# EAGLE design ecg_prototype_1 (EAGLE 9.6.1)
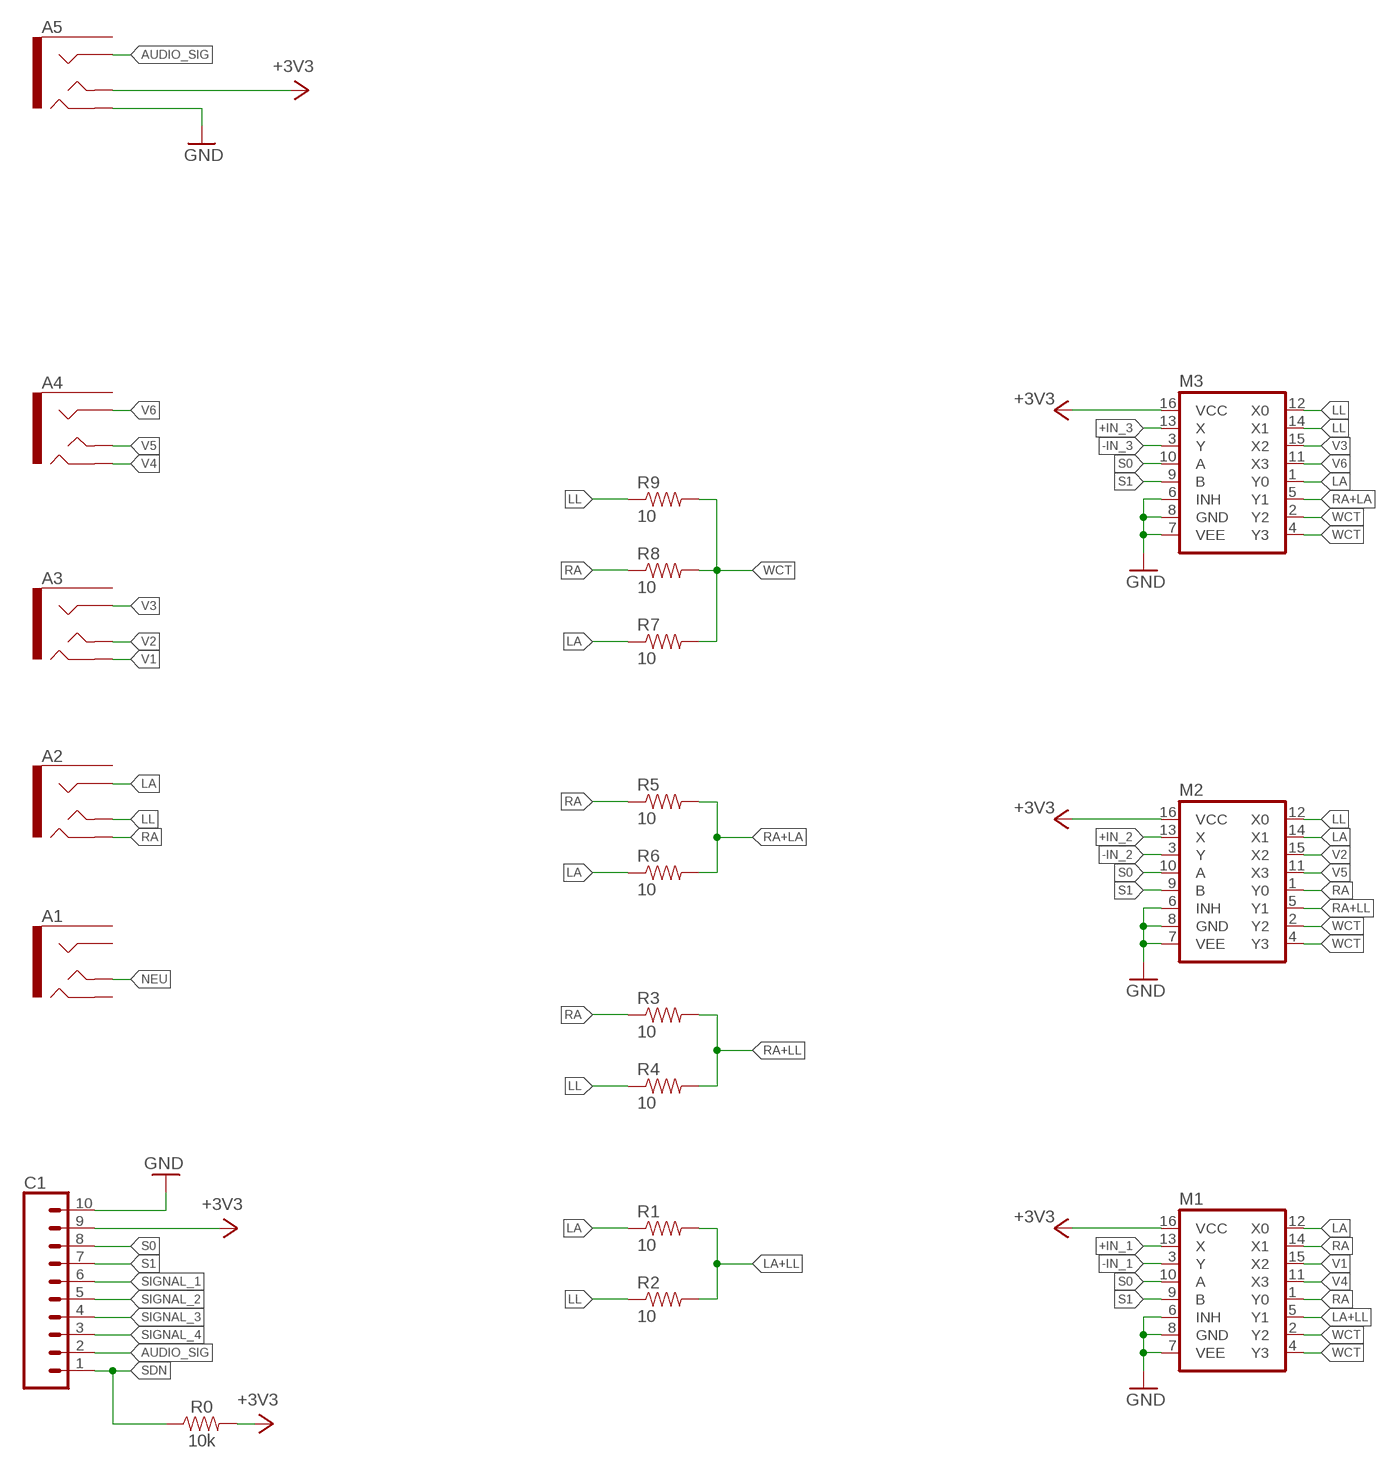
[diagram p0: schematic, sheet 1, part 1 of 2]
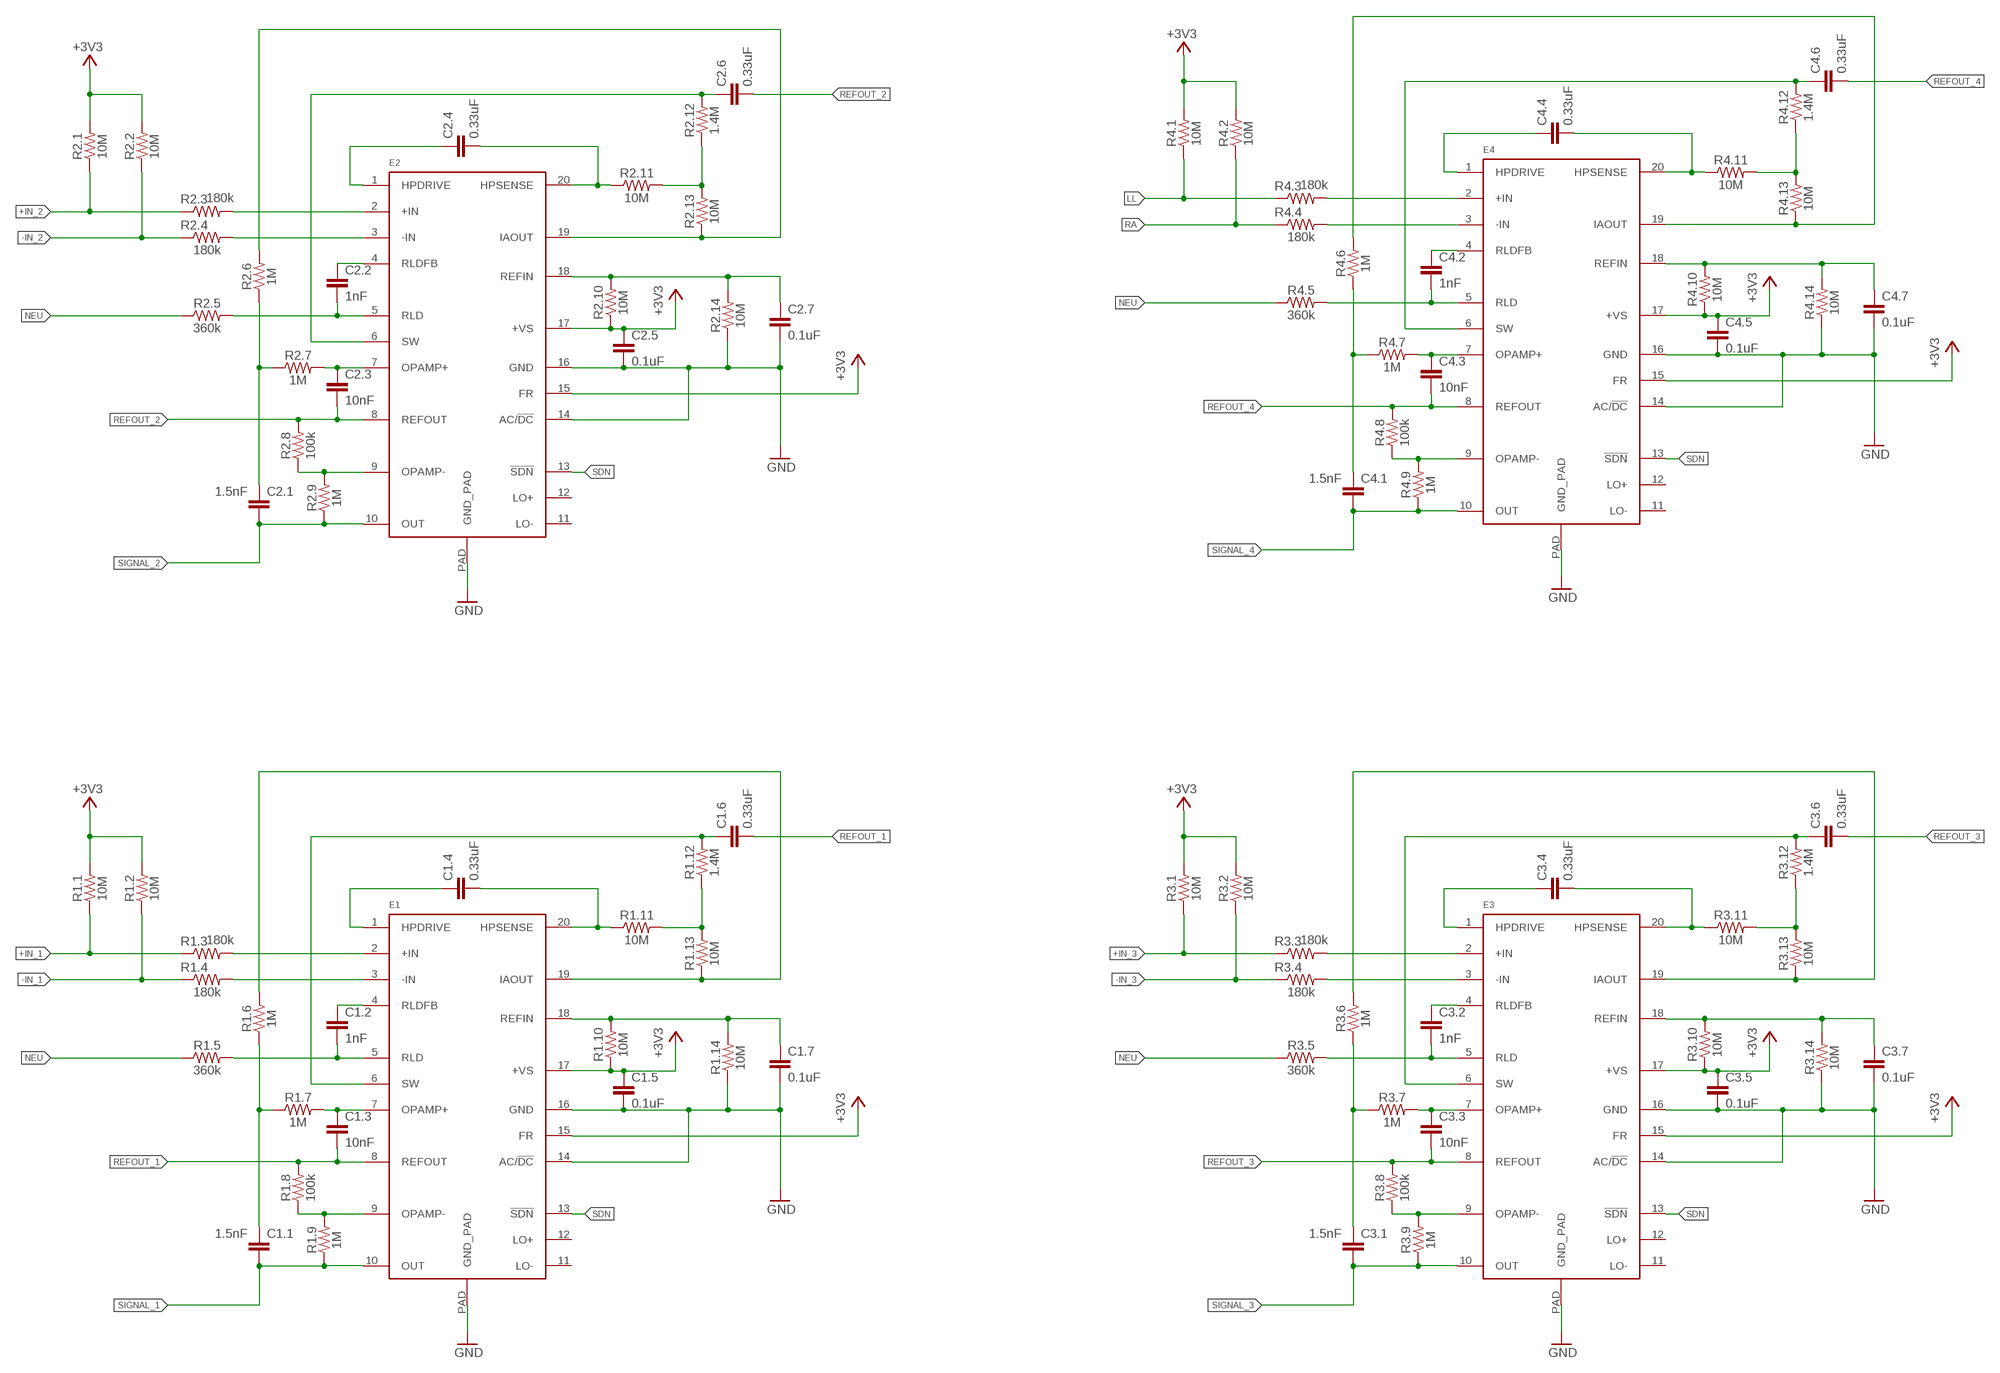
[diagram p1: schematic, sheet 1, part 2 of 2]

## Parts
A1  AUDIO_JACK_TRRSSMD_RA  [AUDIO_JACK_3.5MM_TRRS_SMD_RA]
A2  AUDIO_JACK_TRRSSMD_RA  [AUDIO_JACK_3.5MM_TRRS_SMD_RA]
A3  AUDIO_JACK_TRRSSMD_RA  [AUDIO_JACK_3.5MM_TRRS_SMD_RA]
A4  AUDIO_JACK_TRRSSMD_RA  [AUDIO_JACK_3.5MM_TRRS_SMD_RA]
A5  AUDIO_JACK_TRRSSMD_RA  [AUDIO_JACK_3.5MM_TRRS_SMD_RA]
C1  CONN_10"  [1X10]
C1.1  1.5nF  CAP0603-CAP  [0603-CAP]
C1.2  1nF  CAP0603-CAP  [0603-CAP]
C1.3  10nF  CAP0603-CAP  [0603-CAP]
C1.4  0.33uF  CAP0805  [0805]
C1.5  0.1uF  CAP0603-CAP  [0603-CAP]
C1.6  0.33uF  CAP0805  [0805]
C1.7  0.1uF  CAP0603-CAP  [0603-CAP]
C2.1  1.5nF  CAP0603-CAP  [0603-CAP]
C2.2  1nF  CAP0603-CAP  [0603-CAP]
C2.3  10nF  CAP0603-CAP  [0603-CAP]
C2.4  0.33uF  CAP0805  [0805]
C2.5  0.1uF  CAP0603-CAP  [0603-CAP]
C2.6  0.33uF  CAP0805  [0805]
C2.7  0.1uF  CAP0603-CAP  [0603-CAP]
C3.1  1.5nF  CAP0603-CAP  [0603-CAP]
C3.2  1nF  CAP0603-CAP  [0603-CAP]
C3.3  10nF  CAP0603-CAP  [0603-CAP]
C3.4  0.33uF  CAP0805  [0805]
C3.5  0.1uF  CAP0603-CAP  [0603-CAP]
C3.6  0.33uF  CAP0805  [0805]
C3.7  0.1uF  CAP0603-CAP  [0603-CAP]
C4.1  1.5nF  CAP0603-CAP  [0603-CAP]
C4.2  1nF  CAP0603-CAP  [0603-CAP]
C4.3  10nF  CAP0603-CAP  [0603-CAP]
C4.4  0.33uF  CAP0805  [0805]
C4.5  0.1uF  CAP0603-CAP  [0603-CAP]
C4.6  0.33uF  CAP0805  [0805]
C4.7  0.1uF  CAP0603-CAP  [0603-CAP]
E1  AD8232ACPZ-R7  AD8232  [LFCSP_20]
E2  AD8232ACPZ-R7  AD8232  [LFCSP_20]
E3  AD8232ACPZ-R7  AD8232  [LFCSP_20]
E4  AD8232ACPZ-R7  AD8232  [LFCSP_20]
M1  74HC4052D  [SO16]
M2  74HC4052D  [SO16]
M3  74HC4052D  [SO16]
R0  10k  10KOHM-0603-1/10W-1%  [0603]
R1  10  RESISTOR0402-RES  [0402-RES]
R1.1  10M  RESISTOR0603  [0603]
R1.2  10M  RESISTOR0603  [0603]
R1.3  180k  RESISTOR0603  [0603]
R1.4  180k  RESISTOR0603  [0603]
R1.5  360k  RESISTOR0603  [0603]
R1.6  1M  RESISTOR0603  [0603]
R1.7  1M  RESISTOR0603  [0603]
R1.8  100k  RESISTOR0603  [0603]
R1.9  1M  RESISTOR0603  [0603]
R1.10  10M  RESISTOR0603  [0603]
R1.11  10M  RESISTOR0603  [0603]
R1.12  1.4M  RESISTOR0603  [0603]
R1.13  10M  RESISTOR0603  [0603]
R1.14  10M  RESISTOR0603  [0603]
R2  10  RESISTOR0402-RES  [0402-RES]
R2.1  10M  RESISTOR0603  [0603]
R2.2  10M  RESISTOR0603  [0603]
R2.3  180k  RESISTOR0603  [0603]
R2.4  180k  RESISTOR0603  [0603]
R2.5  360k  RESISTOR0603  [0603]
R2.6  1M  RESISTOR0603  [0603]
R2.7  1M  RESISTOR0603  [0603]
R2.8  100k  RESISTOR0603  [0603]
R2.9  1M  RESISTOR0603  [0603]
R2.10  10M  RESISTOR0603  [0603]
R2.11  10M  RESISTOR0603  [0603]
R2.12  1.4M  RESISTOR0603  [0603]
R2.13  10M  RESISTOR0603  [0603]
R2.14  10M  RESISTOR0603  [0603]
R3  10  RESISTOR0402-RES  [0402-RES]
R3.1  10M  RESISTOR0603  [0603]
R3.2  10M  RESISTOR0603  [0603]
R3.3  180k  RESISTOR0603  [0603]
R3.4  180k  RESISTOR0603  [0603]
R3.5  360k  RESISTOR0603  [0603]
R3.6  1M  RESISTOR0603  [0603]
R3.7  1M  RESISTOR0603  [0603]
R3.8  100k  RESISTOR0603  [0603]
R3.9  1M  RESISTOR0603  [0603]
R3.10  10M  RESISTOR0603  [0603]
R3.11  10M  RESISTOR0603  [0603]
R3.12  1.4M  RESISTOR0603  [0603]
R3.13  10M  RESISTOR0603  [0603]
R3.14  10M  RESISTOR0603  [0603]
R4  10  RESISTOR0402-RES  [0402-RES]
R4.1  10M  RESISTOR0603  [0603]
R4.2  10M  RESISTOR0603  [0603]
R4.3  180k  RESISTOR0603  [0603]
R4.4  180k  RESISTOR0603  [0603]
R4.5  360k  RESISTOR0603  [0603]
R4.6  1M  RESISTOR0603  [0603]
R4.7  1M  RESISTOR0603  [0603]
R4.8  100k  RESISTOR0603  [0603]
R4.9  1M  RESISTOR0603  [0603]
R4.10  10M  RESISTOR0603  [0603]
R4.11  10M  RESISTOR0603  [0603]
R4.12  1.4M  RESISTOR0603  [0603]
R4.13  10M  RESISTOR0603  [0603]
R4.14  10M  RESISTOR0603  [0603]
R5  10  RESISTOR0402-RES  [0402-RES]
R6  10  RESISTOR0402-RES  [0402-RES]
R7  10  RESISTOR0402-RES  [0402-RES]
R8  10  RESISTOR0402-RES  [0402-RES]
R9  10  RESISTOR0402-RES  [0402-RES]

## Nets
+3V3: A5.TIP C1.5.1 C1.9 C2.5.1 C3.5.1 C4.5.1 E1.15(FR) E1.17(+VS) E2.15(FR) E2.17(+VS) E3.15(FR) E3.17(+VS) E4.15(FR) E4.17(+VS) M1.16(VCC) M2.16(VCC) M3.16(VCC) R0.2 R1.1.2 R1.2.2 R1.10.1 R2.1.2 R2.2.2 R2.10.1 R3.1.2 R3.2.2 R3.10.1 R4.1.2 R4.2.2 R4.10.1
+IN_1: M1.13(X) R1.1.1 R1.3.1
+IN_2: M2.13(X) R2.1.1 R2.3.1
+IN_3: M3.13(X) R3.1.1 R3.3.1
-IN_1: M1.3(Y) R1.2.1 R1.4.1
-IN_2: M2.3(Y) R2.2.1 R2.4.1
-IN_3: M3.3(Y) R3.2.1 R3.4.1
AUDIO_SIG: A5.RING1 C1.2
GND: A5.RING2 C1.5.2 C1.7.2 C1.10 C2.5.2 C2.7.2 C3.5.2 C3.7.2 C4.5.2 C4.7.2 E1.14(AC/!DC) E1.16(GND) E1.PAD(GND_PAD) E2.14(AC/!DC) E2.16(GND) E2.PAD(GND_PAD) E3.14(AC/!DC) E3.16(GND) E3.PAD(GND_PAD) E4.14(AC/!DC) E4.16(GND) E4.PAD(GND_PAD) M1.6(INH) M1.7(VEE) M1.8(GND) M2.6(INH) M2.7(VEE) M2.8(GND) M3.6(INH) M3.7(VEE) M3.8(GND) R1.14.1 R2.14.1 R3.14.1 R4.14.1
LA: A2.RING1 M1.12(X0) M2.14(X1) M3.1(Y0) R1.1 R6.1 R7.1
LA+LL: M1.5(Y1) R1.2 R2.2
LL: A2.TIP M2.12(X0) M3.12(X0) M3.14(X1) R2.1 R4.1 R4.1.1 R4.3.1 R9.1
N$1: E1.9(OPAMP-) R1.8.1 R1.9.2
N$2: E2.2(+IN) R2.3.2
N$3: E1.2(+IN) R1.3.2
N$4: E1.3(-IN) R1.4.2
N$5: E2.3(-IN) R2.4.2
N$6: C1.1.1 R1.6.1 R1.7.1
N$7: C1.3.1 E1.7(OPAMP+) R1.7.2
N$8: C1.2.1 E1.4(RLDFB)
N$9: C1.2.2 E1.5(RLD) R1.5.2
N$10: E1.19(IAOUT) R1.6.2 R1.13.1
N$11: C1.6.1 E1.6(SW) R1.12.2
N$12: C1.7.1 E1.18(REFIN) R1.10.2 R1.14.2
N$13: R1.11.2 R1.12.1 R1.13.2
N$14: C1.4.2 E1.20(HPSENSE) R1.11.1
N$15: C1.4.1 E1.1(HPDRIVE)
N$16: C2.2.1 E2.4(RLDFB)
N$17: C2.2.2 E2.5(RLD) R2.5.2
N$19: C2.1.1 R2.6.1 R2.7.1
N$20: C2.3.1 E2.7(OPAMP+) R2.7.2
N$21: E2.9(OPAMP-) R2.8.1 R2.9.2
N$22: E2.19(IAOUT) R2.6.2 R2.13.1
N$23: C2.6.1 E2.6(SW) R2.12.2
N$24: R2.11.2 R2.12.1 R2.13.2
N$25: C2.4.2 E2.20(HPSENSE) R2.11.1
N$26: C2.4.1 E2.1(HPDRIVE)
N$27: C2.7.1 E2.18(REFIN) R2.10.2 R2.14.2
N$28: E3.2(+IN) R3.3.2
N$29: E3.3(-IN) R3.4.2
N$30: C3.2.1 E3.4(RLDFB)
N$31: C3.2.2 E3.5(RLD) R3.5.2
N$32: C3.1.1 R3.6.1 R3.7.1
N$33: C3.3.1 E3.7(OPAMP+) R3.7.2
N$34: E3.9(OPAMP-) R3.8.1 R3.9.2
N$35: E3.19(IAOUT) R3.6.2 R3.13.1
N$36: C3.6.1 E3.6(SW) R3.12.2
N$37: R3.11.2 R3.12.1 R3.13.2
N$38: C3.4.2 E3.20(HPSENSE) R3.11.1
N$39: C3.4.1 E3.1(HPDRIVE)
N$40: C3.7.1 E3.18(REFIN) R3.10.2 R3.14.2
N$41: E4.2(+IN) R4.3.2
N$42: E4.3(-IN) R4.4.2
N$43: C4.2.1 E4.4(RLDFB)
N$44: C4.2.2 E4.5(RLD) R4.5.2
N$45: C4.1.1 R4.6.1 R4.7.1
N$46: C4.3.1 E4.7(OPAMP+) R4.7.2
N$47: E4.9(OPAMP-) R4.8.1 R4.9.2
N$48: E4.19(IAOUT) R4.6.2 R4.13.1
N$49: C4.6.1 E4.6(SW) R4.12.2
N$50: R4.11.2 R4.12.1 R4.13.2
N$51: C4.4.2 E4.20(HPSENSE) R4.11.1
N$52: C4.4.1 E4.1(HPDRIVE)
N$53: C4.7.1 E4.18(REFIN) R4.10.2 R4.14.2
NEU: A1.TIP R1.5.1 R2.5.1 R3.5.1 R4.5.1
RA: A2.RING2 M1.1(Y0) M1.14(X1) M2.1(Y0) R3.1 R4.2.1 R4.4.1 R5.1 R8.1
RA+LA: M3.5(Y1) R5.2 R6.2
RA+LL: M2.5(Y1) R3.2 R4.2
REFOUT_1: C1.3.2 C1.6.2 E1.8(REFOUT) R1.8.2
REFOUT_2: C2.3.2 C2.6.2 E2.8(REFOUT) R2.8.2
REFOUT_3: C3.3.2 C3.6.2 E3.8(REFOUT) R3.8.2
REFOUT_4: C4.3.2 C4.6.2 E4.8(REFOUT) R4.8.2
S0: C1.8 M1.10(A) M2.10(A) M3.10(A)
S1: C1.7 M1.9(B) M2.9(B) M3.9(B)
SDN: C1.1 E1.13(!SDN) E2.13(!SDN) E3.13(!SDN) E4.13(!SDN) R0.1
SIGNAL_1: C1.1.2 C1.6 E1.10(OUT) R1.9.1
SIGNAL_2: C1.5 C2.1.2 E2.10(OUT) R2.9.1
SIGNAL_3: C1.4 C3.1.2 E3.10(OUT) R3.9.1
SIGNAL_4: C1.3 C4.1.2 E4.10(OUT) R4.9.1
V1: A3.RING2 M1.15(X2)
V2: A3.TIP M2.15(X2)
V3: A3.RING1 M3.15(X2)
V4: A4.RING2 M1.11(X3)
V5: A4.TIP M2.11(X3)
V6: A4.RING1 M3.11(X3)
WCT: M1.2(Y2) M1.4(Y3) M2.2(Y2) M2.4(Y3) M3.2(Y2) M3.4(Y3) R7.2 R8.2 R9.2
Unconnected: A1.EARTH A1.RING1 A1.RING2 A2.EARTH A3.EARTH A4.EARTH A5.EARTH E1.11(LO-) E1.12(LO+) E2.11(LO-) E2.12(LO+) E3.11(LO-) E3.12(LO+) E4.11(LO-) E4.12(LO+)

## Library data of the parts
A1-A5 = SparkFun-Connectors:AUDIO_JACK_TRRS: Audio Jack - 3.5mm TRRS (SMD) This is a 3.5mm TRRS SMD audio jack. TRRS connectors are the audio-style connectors that you see on some phones, MP3 players and development boards. TRRS stands for “tip, ring, ring, sleeve,” which reflects that this has three conductors and a ground. SparkFun Products: Audio Jack <https://www.sparkfun.com/products/12639> mbed Starter Kit <https://www.sparkfun.com/products/12968> SparkFun TRRS 3.5mm Jack Breakout <https://www.sparkfun.com/products/11570>; PROD_ID: CONN-10676; SF_ID: PRT-12639
C1 = SparkFun-Connectors:CONN_10: Multi connection point. Often used as Generic Header-pin footprint for 0.1 inch spaced/style header connections On any of the 0.1 inch spaced packages, you can populate with these: Break Away Headers - Straight <https://www.sparkfun.com/products/116> (PRT-00116) Break Away Male Headers - Right Angle <https://www.sparkfun.com/products/553> (PRT-00553) Female Headers <https://www.sparkfun.com/products/115> (PRT-00115) Break Away Headers - Machine Pin <https://www.sparkfun.com/products/117> (PRT-00117) Break Away Female Headers - Swiss Machine Pin <https://www.sparkfun.com/products/743> (PRT-00743) Arduino Stackable Header - 10 Pin <https://www.sparkfun.com/products/11376> (PRT-11376) For SCREWTERMINALS and SPRING TERMINALS visit here: Screw Terimnals on SparkFun.com <https://www.sparkfun.com/search/results?term=Screw+Terminals> (5mm/3.5mm/2.54mm spacing) This device is also useful as a general connection point to wire up your design to another part of your project. Our various solder wires solder well into these plated through hole pads. Hook-Up Wire - Assortment (Stranded, 22 AWG) <https://www.sparkfun.com/products/11375> (PRT-11375) Hook-Up Wire - Assortment (Solid Core, 22 AWG) <https://www.sparkfun.com/products/11367> (PRT-11367) View the entire wire category on our website here <https://www.sparkfun.com/categories/141> Special notes: Molex polarized connector foot print use with SKU : PRT-08231 with associated crimp pins and housings. 1MM SMD Version SKU: PRT-10208 NOTES ON THE VARIANTS LOCK and LOCK_LONGPADS... This footprint was designed to help hold the alignment of a through-hole component (i.e. 6-pin header) while soldering it into place. You may notice that each hole has been shifted either up or down by 0.005 of an inch from it's more standard position (which is a perfectly straight line). This slight alteration caused the pins (the squares in the middle) to touch the edges of the holes. Because they are alternating, it causes a "brace" to hold the component in place. 0.005 has proven to be the perfect amount of "off-center" position when using our standard breakaway headers. Although looks a little odd when you look at the bare footprint, once you have a header in there, the alteration is very hard to notice. Also,if you push a header all the way into place, it is covered up entirely on the bottom side.; PROD_ID: CONN-11563
C1.1-C1.7 C2.1-C2.7 C3.1-C3.7 C4.1-C4.7 = SparkFun-Passives:CAP: Capacitor Standard 0603 ceramic capacitor, and 0.1" leaded capacitor.
E1-E4 = SparkFun-Sensors:AD8232: AD8232 Single Lead Heart Rate Monitor IC Datasheet <https://cdn.sparkfun.com/datasheets/Sensors/Biometric/AD8232.pdf> SparkFun Products SparkFun Single Lead Heart Rate Monitor - AD8232 <https://www.sparkfun.com/products/12650> (SEN-12650); PROD_ID: IC-11886
M1-M3 = SparkFun-IC-Logic:74*4052: Dual 4:1 Analog Mux Dual four-channel analog MULTIPLEXER / DEMULTIPLEXER SparkFun Products SparkFun Vernier Interface Shield <https://www.sparkfun.com/products/12858> (DEV-12858); PROD_ID: IC-13103
R0 = SparkFun-Resistors:10KOHM: 10kΩ resistor A resistor is a passive two-terminal electrical component that implements electrical resistance as a circuit element. Resistors act to reduce current flow, and, at the same time, act to lower voltage levels within circuits. - Wikipedia; PROD_ID: RES-00824
R1-R9 = SparkFun:RESISTOR: Resistor Basic schematic elements and footprints for 0603, 1206, and PTH resistors.
R1.1-R1.14 R2.1-R2.14 R3.1-R3.14 R4.1-R4.14 = SparkFun-Resistors:RESISTOR: Generic Resistor Package

## Board
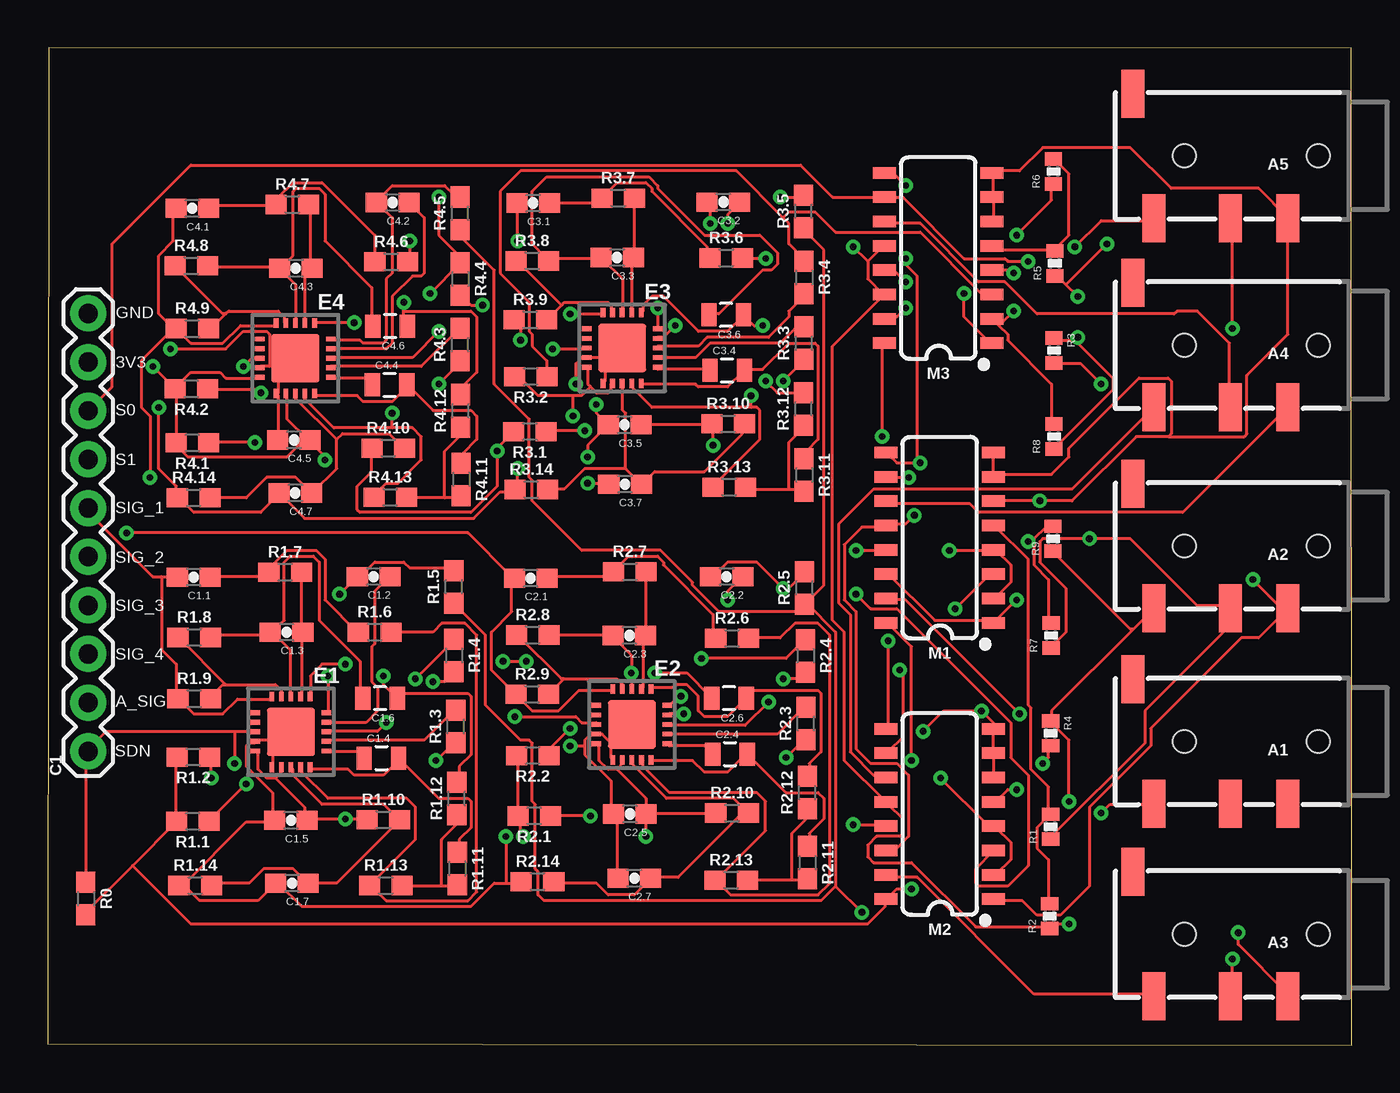
[diagram p2: board, top side]
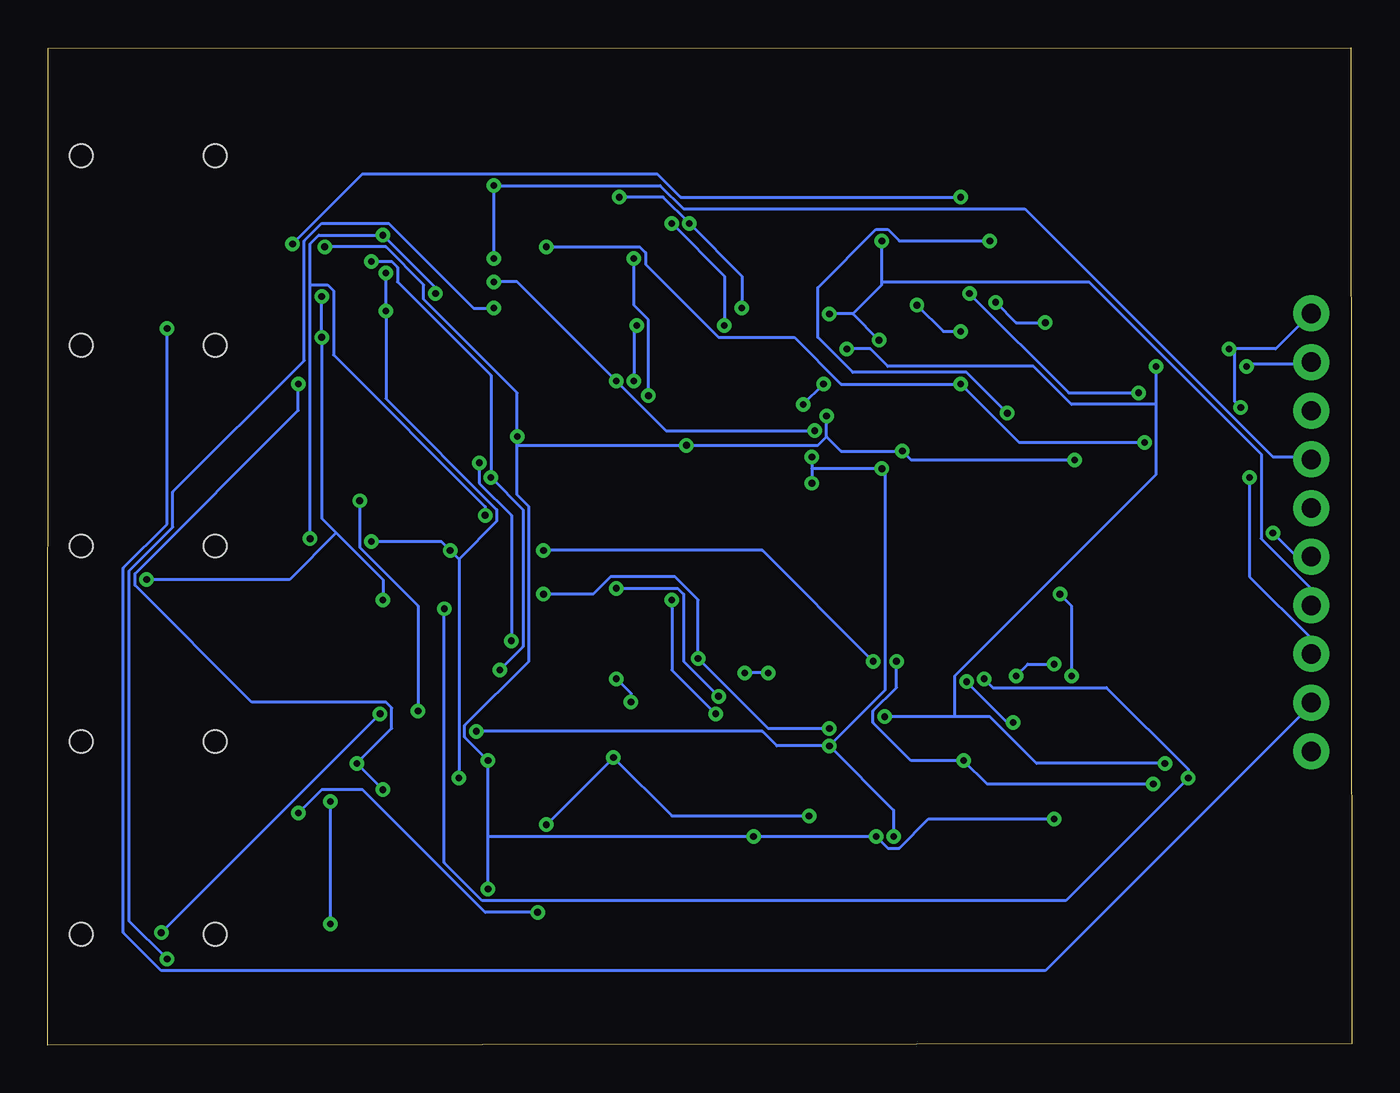
[diagram p3: board, bottom side, seen from below]

Size 68.1 x 52.07 mm. Coordinates in mm from the lower left corner, seen from the top.
Outline: 0,0.08 68.1,0 68.08,52.05 0.05,52.07 0,0.08
Copper layers (1*16): Top 0.035mm / dielectric 1.5mm / Bottom 0.035mm
Design rules "default": minimum track width 6mil, minimum drill 0.35mm, track to track 6mil, track to pad 6mil, pad to pad 6mil, via to via 6mil, smd to smd 6mil, copper to edge 40mil, drill to drill 6mil, minimum pad ring 10mil, minimum via ring 8mil, stop-mask expansion 4mil, vias tented up to drill 0mil, thermal gap 10mil

### Footprints (pad centres in the part's own frame; a part is rotated, then mirrored left to right if it is on the bottom)
AUDIO_JACK_3.5MM_TRRS_SMD_RA = smd 1.2 x 2.5: EARTH 11.3,-3.25; RING1 6.2,3.25; RING2 3.2,3.25; TIP 10.2,3.25 | hole 1.2: 1.6,0; 8.6,0
1X10 = drill 1.016 pad 1.88: 1 0,0; 2 2.54,0; 3 5.08,0; 4 7.62,0; 5 10.16,0; 6 12.7,0; 7 15.24,0; 8 17.78,0; 9 20.32,0; 10 22.86,0
0603-CAP = smd 1.1 x 1: 1 -0.85,0; 2 0.85,0
0805 = smd 0.8 x 1.2: 1 -0.9,0; 2 0.9,0
LFCSP_20 = smd 0.5 x 0.25: 1 -1.85,1; 2 -1.85,0.5; 3 -1.85,0; 4 -1.85,-0.5; 5 -1.85,-1; 11 1.85,-1; 12 1.85,-0.5; 13 1.85,0; 14 1.85,0.5; 15 1.85,1 | smd 0.25 x 0.5: 6 -1,-1.85; 7 -0.5,-1.85; 8 0,-1.85; 9 0.5,-1.85; 10 1,-1.85; 16 1,1.85; 17 0.5,1.85; 18 0,1.85; 19 -0.5,1.85; 20 -1,1.85 | smd 2.5 x 2.5: PAD 0,0
SO16 = smd 0.6 x 1.2: 1 -4.445,-2.8; 2 -3.175,-2.8; 3 -1.905,-2.8; 4 -0.635,-2.8; 5 0.635,-2.8; 6 1.905,-2.8; 7 3.175,-2.8; 8 4.445,-2.8; 9 4.445,2.8; 10 3.175,2.8; 11 1.905,2.8; 12 0.635,2.8; 13 -0.635,2.8; 14 -1.905,2.8; 15 -3.175,2.8; 16 -4.445,2.8
0603 = smd 1.1 x 1: 1 -0.85,0; 2 0.85,0
0402-RES = smd 0.7 x 0.9: 1 -0.65,0; 2 0.65,0

### Placement (x,y rotation side)
A1  67.97,15.85 180 top
A2  67.97,26.06 180 top
A3  67.97,5.79 180 top
A4  67.97,36.55 180 top
A5  67.97,46.43 180 top
C1  2.11,15.34 90 top
C1.1  7.62,24.43 180 top
C1.2  17.02,24.46 180 top
C1.3  12.47,21.56 180 top
C1.4  17.42,14.99 0 top
C1.5  12.7,11.73 180 top
C1.6  17.35,18.11 180 top
C1.7  12.75,8.46 180 top
C2.1  25.22,24.38 180 top
C2.2  35.46,24.46 180 top
C2.3  30.38,21.39 180 top
C2.4  35.64,15.19 0 top
C2.5  30.4,12.06 180 top
C2.6  35.59,18.11 180 top
C2.7  30.63,8.71 180 top
C3.1  25.35,43.97 180 top
C3.2  35.28,44.02 180 top
C3.3  29.74,41.12 180 top
C3.4  35.48,35.23 0 top
C3.5  30.12,32.38 180 top
C3.6  35.43,38.13 180 top
C3.7  30.15,29.29 180 top
C4.1  7.54,43.69 180 top
C4.2  18.01,43.99 180 top
C4.3  12.95,40.56 180 top
C4.4  17.86,34.47 0 top
C4.5  12.85,31.6 180 top
C4.6  17.88,37.54 180 top
C4.7  12.93,28.83 180 top
E1  12.7,16.36 180 top
E2  30.51,16.74 180 top
E3  30,36.4 180 top
E4  12.93,35.86 180 top
M1  46.58,26.49 90 top
M2  46.58,12.06 90 top
M3  46.51,41.1 90 top
R0  1.98,7.65 270 top
R1  52.37,11.4 90 top
R1.1  7.57,11.68 180 top
R1.2  7.59,15.04 180 top
R1.3  21.31,16.64 90 top
R1.4  21.21,20.35 270 top
R1.5  21.21,23.93 90 top
R1.6  17.07,21.56 0 top
R1.7  12.4,24.69 0 top
R1.8  7.65,21.29 0 top
R1.9  7.65,18.08 0 top
R1.10  17.53,11.76 0 top
R1.11  21.39,9.22 270 top
R1.12  21.36,12.88 90 top
R1.13  17.65,8.33 0 top
R1.14  7.7,8.33 0 top
R2  52.32,6.73 90 top
R2.1  25.4,11.96 180 top
R2.2  25.32,15.11 180 top
R2.3  39.6,16.79 90 top
R2.4  39.57,20.32 270 top
R2.5  39.52,23.88 90 top
R2.6  35.74,21.23 0 top
R2.7  30.4,24.71 0 top
R2.8  25.32,21.41 0 top
R2.9  25.3,18.31 0 top
R2.10  35.74,12.12 0 top
R2.11  39.67,9.53 270 top
R2.12  39.67,13.18 90 top
R2.13  35.69,8.61 0 top
R2.14  25.58,8.53 0 top
R3  52.55,36.27 270 top
R3.1  25.17,32.03 180 top
R3.2  25.22,34.9 180 top
R3.3  39.5,36.65 90 top
R3.4  39.5,40.08 270 top
R3.5  39.47,43.54 90 top
R3.6  35.43,41.1 0 top
R3.7  29.79,44.22 0 top
R3.8  25.3,40.94 0 top
R3.9  25.2,37.87 0 top
R3.10  35.53,32.44 0 top
R3.11  39.5,29.77 270 top
R3.12  39.47,33.22 90 top
R3.13  35.59,29.13 0 top
R3.14  25.25,29.01 0 top
R4  52.37,16.28 270 top
R4.1  7.54,31.45 180 top
R4.2  7.49,34.26 180 top
R4.3  21.54,36.58 90 top
R4.4  21.54,40.01 270 top
R4.5  21.54,43.43 90 top
R4.6  17.93,40.89 0 top
R4.7  12.78,43.89 0 top
R4.8  7.49,40.69 0 top
R4.9  7.54,37.41 0 top
R4.10  17.78,31.17 0 top
R4.11  21.59,29.54 270 top
R4.12  21.56,33.12 90 top
R4.13  17.88,28.6 0 top
R4.14  7.62,28.57 0 top
R5  52.6,40.82 90 top
R6  52.53,45.62 90 top
R7  52.4,21.39 90 top
R8  52.55,31.78 90 top
R9  52.5,26.44 90 top

### Tracks (layer width: path | path; a pad name or v marks a point on that pad's centre or on a via)
+3V3  (via drill 0.35)
  Top 0.152: E4.17 12.5,33.91 12.5,32.69 13.56,31.62 C4.5.1 | E4.15 10.97,34.82 9.3,34.82 8.99,35.13 7.47,35.13 6.71,34.37 R4.2.2 | R4.2.2 6.71,34.21 6.71,31.47 R4.1.2 6.71,31.32 7.32,30.71 12.5,30.71 13.26,31.47 13.56,31.47 C4.5.1 | v5.49,35.43 6.55,34.37 R4.2.2 | R4.10.1 16.92,31.17 16.92,29.95 16.15,29.18 16.15,27.97 16.31,27.81 22.1,27.81 23.47,29.18 v23.47,31.01 23.47,31.17 24.23,31.93 R3.1.2 | 29.72,14.4 29.26,14.4 28.8,14.86 28.8,15.62 E2.15 | 29.72,14.4 30.02,14.71 30.02,14.86 E2.17 | 29.72,14.4 31.24,12.88 31.24,12.12 C2.5.1 | R2.10.1 31.39,12.12 C2.5.1 | 11.89,13.94 11.43,13.94 10.97,14.4 10.97,15.32 E1.15 | 11.89,13.94 12.19,14.25 12.19,14.4 E1.17 | 11.89,13.94 13.41,12.42 13.41,11.81 C1.5.1 13.56,11.81 v15.54,11.81 16.61,11.81 R1.10.1 | 28.35,34.37 28.19,34.52 28.19,35.28 E3.15 | 28.35,34.37 28.65,34.06 29.26,34.06 29.41,34.21 29.41,34.52 E3.17 | 27.43,33.91 27.89,33.91 28.35,34.37 | 27.43,33.91 25.6,33.91 24.69,34.82 24.38,34.82 R3.2.2 | C3.5.1 34.59,32.39 R3.10.1 34.75,32.39 v34.75,31.32 | R2.2.2 24.54,15.01 24.54,11.96 R2.1.2 24.69,11.96 24.69,11.05 v24.84,10.9 | 4.42,9.37 6.71,11.66 R1.1.2 6.71,11.81 6.71,15.01 R1.2.2 | 4.42,9.37 1.98,6.93 R0.2 | 4.42,9.37 7.47,6.32 42.82,6.32 43.74,7.24 43.74,7.54 M2.16 43.89,7.7 44.35,8.15 v45.11,8.15 | v45.11,14.86 45.11,20.8 43.89,22.02 M1.16 | v43.59,31.78 43.59,36.65 M3.16 | v53.65,41.68 55.02,43.05 57.76,43.05 A5.TIP | v27.43,32.84 27.43,33.91 | v31.24,10.9 31.24,11.96 C2.5.1 | v14.48,30.56 14.48,30.71 13.72,31.47 C4.5.1
  Bottom 0.152: v5.49,35.43 5.33,35.59 2.13,35.59 C1.9 | v45.11,8.15 45.11,10.9 | 45.11,10.9 v45.11,14.86 46.33,16.08 46.33,16.69 42.98,20.04 42.98,28.12 43.59,28.73 43.59,31.32 | 43.59,31.32 v43.59,31.78 43.59,34.06 48.46,38.94 48.46,39.7 50.44,41.68 v53.65,41.68 | 45.11,10.9 v31.24,10.9 v24.84,10.9 24.23,10.29 23.62,10.29 22.1,11.81 v15.54,11.81 | 43.59,31.32 v34.75,31.32 27.89,31.32 27.43,31.78 | 27.43,31.78 v27.43,32.84 | 27.43,31.78 26.67,31.01 v23.47,31.01 23.01,30.56 v14.48,30.56
+IN_1  (via drill 0.35)
  Top 0.152: v10.36,13.64 8.53,11.81 R1.1.1 | v20.27,14.86 21.18,15.77 R1.3.1 | v42.22,25.83 43.74,25.83 M1.13 | v23.77,20.04 v24.99,20.04
  Bottom 0.152: v10.36,13.64 19.05,13.64 v20.27,14.86 23.01,14.86 24.99,16.84 24.99,17.45 23.77,18.67 v23.77,20.04 | v42.22,25.83 30.79,25.83 v24.99,20.04
+IN_2  (via drill 0.35)
  Top 0.152: v28.35,11.96 R2.1.1 | v38.56,15.01 39.47,15.93 R2.3.1 | v42.06,11.51 43.74,11.51 M2.13
  Bottom 0.152: v28.35,11.96 35.51,11.96 v38.56,15.01 v42.06,11.51
+IN_3  (via drill 0.35)
  Top 0.152: v28.04,32.08 26.06,32.08 R3.1.1 | v38.41,34.67 39.47,35.74 R3.3.1 | M3.13 44.2,40.46 v44.81,39.85
  Bottom 0.152: v28.04,32.08 35.81,32.08 v38.41,34.67 43.59,39.85 v44.81,39.85
-IN_1  (via drill 0.35)
  Top 0.152: v8.53,13.94 8.53,15.01 R1.2.1 | v19.2,19.13 21.18,21.11 R1.4.1 | v47.4,22.78 49.07,24.46 49.38,24.46 M1.3
  Bottom 0.152: v19.2,19.13 18.75,18.67 12.8,18.67 8.53,14.4 v8.53,13.94 14.94,7.54 45.41,7.54 47.4,9.53 v47.4,22.78
-IN_2  (via drill 0.35)
  Top 0.152: v27.28,16.54 26.21,15.47 26.21,15.16 R2.2.1 | v34.14,20.19 38.56,20.19 39.47,21.11 R2.4.1 | v42.22,23.55 42.98,22.78 44.35,22.78 50.29,16.84 50.29,15.01 51.21,14.1 51.21,9.37 50.14,8.31 48.62,8.31 48.46,8.46 48.46,9.22 49.38,10.13 M2.3
  Bottom 0.152: v27.28,16.54 30.48,16.54 v34.14,20.19 34.14,23.24 35.36,24.46 38.71,24.46 39.62,23.55 v42.22,23.55
-IN_3
  Top 0.152: 38.41,43.21 38.71,42.9 38.71,41.83 39.47,41.07 R3.4.1 | 38.41,43.21 35.97,45.64 24.69,45.64 23.62,44.58 23.62,40.31 25.15,38.79 25.15,37.26 25.3,37.11 25.3,36.5 26.06,35.74 26.06,34.98 R3.2.1 | 38.41,43.21 38.71,43.51 40.08,43.51 41.15,42.44 45.57,42.44 48.77,39.24 49.23,39.24 M3.3
AUDIO_SIG  (via drill 0.35)
  Top 0.152: v61.87,37.41 61.87,43.05 A5.RING1
  Bottom 0.152: v61.87,37.41 61.87,27.2 64.16,24.92 64.16,5.87 62.18,3.89 16,3.89 2.13,17.75 C1.2
GND  (via drill 0.35)
  Top 0.152: 49.38,44.27 49.38,43.05 M3.6 | 49.38,44.27 49.38,45.49 M3.8 49.38,45.64 50.75,45.64 51.97,46.86 56.54,46.86 58.67,44.73 63.25,44.73 64.77,43.21 A5.RING2 64.77,43.05 64.77,37.11 62.64,34.98 62.64,31.93 62.48,31.78 58.52,31.78 | 49.38,44.27 M3.7 | M2.6 49.38,14.1 49.38,15.16 M2.7 49.38,15.32 49.38,16.38 M2.8 49.38,16.54 49.38,16.84 v48.77,17.45 46.79,17.45 v45.72,16.38 | 58.52,31.78 56.84,31.78 53.49,28.42 v51.82,28.42 49.53,28.42 M1.6 | 58.52,31.78 58.67,31.93 58.67,34.67 58.52,34.82 57,34.82 53.34,31.17 53.34,30.71 52.43,29.79 49.53,29.79 M1.7 49.38,29.79 49.38,30.86 M1.8 | 11.73,15.93 12.34,15.93 12.65,16.23 E1.PAD 11.73,15.93 | 11.73,15.93 10.97,15.93 E1.14 10.82,15.77 10.52,15.77 10.36,15.62 10.36,14.55 11.73,13.18 11.73,11.81 C1.5.2 11.73,11.66 10.36,11.66 7.01,8.31 | 11.73,15.93 11.73,14.55 E1.16 | 7.01,8.31 7.16,8.31 7.92,7.54 10.97,7.54 11.89,8.46 C1.7.2 12.04,8.46 13.26,7.24 22.1,7.24 23.32,8.46 23.93,8.46 | 7.01,8.31 6.86,8.31 R1.14.1 7.01,8.31 | 23.93,8.46 24.69,8.46 R2.14.1 | 12.04,35.43 12.5,35.43 E4.PAD 12.04,35.43 | 12.04,35.43 11.58,35.43 | 11.58,35.43 11.12,35.43 E4.14 | 12.04,35.43 12.04,34.06 E4.16 12.04,33.91 12.04,31.62 C4.5.2 | 11.58,35.43 11.58,37.11 11.43,37.26 10.21,37.26 9.3,36.35 v6.4,36.35 | C2.7.2 29.72,8.76 29.72,11.81 29.57,11.96 C2.5.2 29.41,12.12 29.41,13.79 28.04,15.16 28.04,15.62 | 29.41,15.77 28.96,16.23 28.8,16.23 E2.14 28.35,16.23 28.04,15.93 28.04,15.62 | 29.41,15.77 29.41,15.01 E2.16 | 29.41,15.77 30.48,16.84 E2.PAD | 29.11,35.89 29.41,35.89 29.87,36.35 E3.PAD 29.11,35.89 | 29.11,35.89 28.19,35.89 E3.14 28.04,35.89 27.89,35.89 27.58,35.59 v27.58,34.52
  Top 0.152: 29.11,35.89 29.11,34.67 E3.16 | v28.19,29.34 29.26,29.34 C3.7.2 | v28.19,30.71 28.19,31.32 C3.5.2 | v24.54,30.1 24.54,29.03 R3.14.1 24.38,28.88 23.62,28.88 22.25,27.51 13.41,27.51 12.19,28.73 C4.7.2 12.04,28.73 11.12,27.81 7.62,27.81 6.86,28.58 R4.14.1 6.71,28.58 6.71,29.18 5.79,30.1 v5.79,33.3 | v28.65,33.45 28.65,32.99 C3.5.2 | C3.5.2 | v27.28,15.62 28.04,15.62 | v23.93,10.9 23.93,8.46
  Bottom 0.152: v48.77,17.45 48.77,22.94 51.82,25.98 v51.82,28.42 | 6.1,36.35 3.96,36.35 C1.10 | v28.19,30.71 28.19,30.1 | 28.19,30.1 v28.19,29.34 | 28.19,30.1 v24.54,30.1 24.38,29.95 24.38,18.52 v27.28,15.62 | v28.65,33.45 v27.58,34.52 | 6.1,36.35 6.1,33.6 v5.79,33.3 | 6.1,36.35 v6.4,36.35 | v23.93,10.9 23.93,12.27 v27.28,15.62 | v45.72,16.38 30.79,16.38 30.02,15.62 v27.28,15.62
LA  (via drill 0.35)
  Top 0.152: M2.14 43.89,10.29 44.35,10.29 44.96,10.9 44.96,14.1 44.35,14.71 42.98,14.71 42.22,15.47 42.22,22.63 41.6,23.24 41.6,26.14 42.52,27.05 43.74,27.05 M1.12 43.89,27.2 44.81,27.2 v45.26,27.66 | v50.6,42.29 52.43,44.12 52.43,44.88 R6.1 | v47.85,39.24 47.85,38.02 49.23,36.65 M3.1 | R1.1 52.43,10.9 57.3,15.77 57.3,17.45 61.72,21.87 61.72,22.78 A2.RING1 61.72,22.94 60.05,22.94 56.54,26.44 v54.41,26.44 51.97,26.44 51.82,26.29 51.82,25.22 53.19,23.85 53.19,21.56 52.43,20.8 R7.1
  Bottom 0.152: v47.85,39.24 47.85,39.55 v50.6,42.29 53.95,42.29 54.41,41.83 54.41,39.7 | v54.41,26.44 54.41,39.7 | v45.26,27.66 45.26,28.12 53.19,36.04 53.19,39.4 53.49,39.7 54.41,39.7
LA+LL
  Top 0.152: R2.2 52.27,7.39 52.27,9.68 51.66,10.29 51.66,11.35 52.27,11.96 R1.2 52.27,12.12 52.27,13.49 51.36,14.4 51.36,17.6 51.21,17.75 51.21,25.37 49.53,27.05 M1.5
LL  (via drill 0.35)
  Top 0.152: v10.82,31.47 8.53,31.47 R4.1.1 | v20.42,34.52 21.49,35.59 R4.3.1 | 56.69,21.72 57.76,22.78 A2.TIP | 56.69,21.72 52.43,17.45 52.43,16.99 R4.1 52.43,16.84 53.34,15.93 v53.34,12.73 | 56.69,21.72 56.54,21.72 52.58,25.68 R9.1 | 42.82,40.92 42.82,40.01 43.59,39.24 M3.14 43.59,39.09 41,36.5 41,22.17 41.6,21.56 41.6,14.86 43.74,12.73 M2.12 43.89,12.57 44.65,11.81 44.65,11.05 44.5,10.9 43.28,10.9 42.82,10.44 42.82,9.83 43.13,9.53 45.11,9.53 48.46,6.17 52.27,6.17 R2.1 52.43,6.17 52.58,6.32 v53.34,6.32 | 42.82,40.92 43.59,41.68 M3.12 | 42.82,40.92 v42.06,41.68
  Bottom 0.152: v10.82,31.47 17.37,31.47 v20.42,34.52 26.67,34.52 29.11,36.96 33.07,36.96 36.88,40.77 36.88,41.38 37.19,41.68 v42.06,41.68 | v53.34,6.32 v53.34,12.73
N$1
  Top 0.152: 9.3,18.82 9.14,18.82 8.53,18.21 R1.9.2 | 9.3,18.82 11.89,18.82 12.19,18.52 E1.9 | 9.3,18.82 6.86,21.26 R1.8.1
N$2
  Top 0.152: E2.2 32.46,16.23 38.1,16.23 39.47,17.6 R2.3.2
N$3
  Top 0.152: E1.2 14.63,15.93 19.66,15.93 21.18,17.45 R1.3.2
N$4  (via drill 0.35)
  Top 0.152: v17.68,16.84 17.22,16.38 14.63,16.38 E1.3 | v20.12,18.97 20.73,18.97 21.18,19.43 R1.4.2
  Bottom 0.152: v17.68,16.84 17.98,16.84 v20.12,18.97
N$5  (via drill 0.35)
  Top 0.152: v37.64,17.91 36.42,16.69 32.46,16.69 E2.3 | v38.41,19.13 39.17,19.13 39.47,19.43 R2.4.2
  Bottom 0.152: v37.64,17.91 37.64,18.36 v38.41,19.13
N$6
  Top 0.152: C1.1.1 8.53,24.46 11.28,24.46 11.43,24.61 R1.7.1 11.43,24.77 12.5,25.83 14.02,25.83 14.48,25.37 14.48,23.24 16.15,21.56 R1.6.1
N$7
  Top 0.152: 13.26,21.56 13.26,18.21 E1.7 | 13.26,21.56 13.26,24.61 R1.7.2 | 13.26,21.56 C1.3.1
N$8
  Top 0.152: E1.4 14.63,16.84 16.61,16.84 17.22,17.45 17.22,18.67 16.92,18.97 16.92,20.8 17.07,20.96 17.07,23.7 17.83,24.46 C1.2.1
N$9  (via drill 0.35)
  Top 0.152: v14.63,19.28 14.63,17.45 E1.5 | v15.24,23.55 16.15,24.46 C1.2.2 16.31,24.46 17.07,25.22 18.59,25.22 18.9,24.92 21.18,24.92 R1.5.2
  Bottom 0.152: v14.63,19.28 14.63,22.94 v15.24,23.55
N$10
  Top 0.152: E1.19 13.26,14.4 13.26,14.25 14.63,12.88 18.75,12.88 19.2,12.42 19.2,10.74 16.92,8.46 R1.13.1 16.92,8.31 17.68,7.54 21.95,7.54 22.4,8 22.4,21.41 21.79,22.02 20.57,22.02 20.12,21.56 R1.6.2
N$11  (via drill 0.35)
  Top 0.152: v15.54,19.89 14.33,19.89 13.72,19.28 13.72,18.21 E1.6 | v17.53,19.28 17.53,18.82 18.14,18.21 C1.6.1 18.29,18.21 18.44,18.36 21.95,18.36 22.1,18.21 22.1,15.16 21.49,14.55 21.49,13.79 R1.12.2
  Bottom 0.152: v15.54,19.89 16.92,19.89 v17.53,19.28
N$12
  Top 0.152: R1.14.2 8.69,8.46 10.52,8.46 11.28,9.22 12.8,9.22 13.56,8.46 C1.7.1 15.09,8.46 18.29,11.66 R1.10.2 18.29,11.81 17.53,12.57 14.33,12.57 12.8,14.1 12.8,14.4 E1.18
N$13
  Top 0.152: 20.57,8.31 21.34,8.31 R1.11.2 | 20.57,8.31 18.59,8.31 R1.13.2 | 20.57,8.31 20.57,10.74 21.34,11.51 21.34,11.96 R1.12.1
N$14
  Top 0.152: E1.20 13.72,14.4 15.7,14.4 16,14.1 17.53,14.1 18.29,14.86 C1.4.2 18.44,14.86 20.42,12.88 21.95,12.88 22.1,12.73 22.1,11.35 21.49,10.74 21.49,10.13 R1.11.1
N$15
  Top 0.152: E1.1 14.63,15.32 16.15,15.32 16.46,15.01 C1.4.1
N$16  (via drill 0.35)
  Top 0.152: v33.22,17.3 32.46,17.3 E2.4 | v35.51,23.24 35.51,23.7 36.27,24.46 C2.2.1
  Bottom 0.152: v33.22,17.3 35.51,19.58 v35.51,23.24
N$17  (via drill 0.35)
  Top 0.152: v33.07,18.21 32.92,18.21 32.46,17.75 E2.5 | R2.5.2 39.47,24.61 38.71,23.85 v38.41,23.85 37.03,25.22 35.51,25.22 34.75,24.46 C2.2.2
  Bottom 0.152: v33.07,18.21 34.9,20.04 34.9,23.55 35.2,23.85 v38.41,23.85
N$19
  Top 0.152: C2.1.1 26.21,24.46 29.26,24.46 29.41,24.61 R2.7.1 29.57,24.77 30.33,25.53 31.85,25.53 32.16,25.22 32.16,25.07 34.75,22.48 34.75,21.26 R2.6.1
N$20
  Top 0.152: E2.7 31.09,18.67 31.09,21.26 C2.3.1 31.24,21.41 31.24,24.61 R2.7.2
N$21
  Top 0.152: 26.98,19.13 29.72,19.13 30.02,18.82 30.02,18.67 E2.9 | 26.98,19.13 26.21,18.36 R2.9.2 | 26.98,19.13 26.82,19.13 24.54,21.41 R2.8.1
N$22
  Top 0.152: 34.9,8.61 37.49,11.2 37.49,12.73 37.03,13.18 32.46,13.18 31.09,14.55 31.09,14.86 E2.19 | 34.9,8.61 35.66,7.85 40.23,7.85 40.84,8.46 40.84,21.41 40.23,22.02 39.01,22.02 38.25,21.26 36.73,21.26 R2.6.2 | 34.9,8.61 R2.13.1
N$23
  Top 0.152: E2.6 31.55,18.67 32.61,18.67 32.77,18.82 33.38,18.82 33.98,18.21 33.98,17.45 34.29,17.15 35.51,17.15 36.42,18.06 C2.6.1 36.58,18.21 36.88,18.52 40.23,18.52 40.39,18.36 40.39,15.32 39.78,14.71 39.78,14.1 R2.12.2
N$24
  Top 0.152: 38.86,8.61 39.62,8.61 R2.11.2 | 38.86,8.61 R2.13.2 | 38.86,8.61 38.86,11.05 39.62,11.81 39.62,12.27 R2.12.1
N$25
  Top 0.152: E2.20 31.55,14.86 33.68,14.86 34.29,14.25 35.51,14.25 36.42,15.16 C2.4.2 36.58,15.16 38.56,13.18 40.23,13.18 40.54,12.88 40.54,11.81 39.78,11.05 39.78,10.44 R2.11.1
N$26
  Top 0.152: E2.1 32.46,15.62 34.29,15.62 34.59,15.32 C2.4.1
N$27
  Top 0.152: R2.14.2 26.52,8.46 28.65,8.46 29.26,7.85 30.63,7.85 31.39,8.61 C2.7.1 31.55,8.76 32.92,8.76 36.42,12.27 | 36.42,12.27 36.58,12.12 R2.10.2 36.42,12.27 | 36.42,12.27 35.81,12.88 32.31,12.88 30.48,14.71 30.48,14.86 E2.18
N$28
  Top 0.152: E3.2 33.83,35.89 34.59,36.65 38.25,36.65 39.01,37.41 39.47,37.41 R3.3.2
N$29
  Top 0.152: E3.3 31.85,36.5 33.98,36.5 34.44,36.96 37.64,36.96 38.71,38.02 38.71,38.33 39.47,39.09 R3.4.2
N$30  (via drill 0.35)
  Top 0.152: v32.77,37.57 32.16,36.96 31.85,36.96 E3.4 | v35.51,42.9 35.51,43.36 36.12,43.97 C3.2.1
  Bottom 0.152: v32.77,37.57 32.77,40.16 v35.51,42.9
N$31  (via drill 0.35)
  Top 0.152: v31.85,38.48 31.85,37.41 E3.5 | v34.59,42.9 34.59,43.82 34.44,43.97 C3.2.2 | v38.25,44.27 39.47,44.27 R3.5.2
  Bottom 0.152: v31.85,38.48 31.85,40.16 v34.59,42.9 35.97,44.27 v38.25,44.27
N$32
  Top 0.152: C3.1.1 28.65,43.97 28.8,44.12 R3.7.1 28.96,44.27 29.72,45.03 31.24,45.03 31.55,44.73 31.55,44.58 34.44,41.68 34.44,41.22 R3.6.1
N$33
  Top 0.152: E3.7 30.48,38.33 30.48,41.07 C3.3.1 30.63,41.22 30.63,44.12 R3.7.2
N$34
  Top 0.152: 26.82,38.63 R3.9.2 | 26.82,38.63 26.98,38.79 29.26,38.79 29.41,38.63 29.41,38.33 E3.9 | 26.82,38.63 24.54,40.92 R3.8.1
N$35  (via drill 0.35)
  Top 0.152: 36.73,33.3 37.03,33.3 37.19,33.15 37.19,31.62 34.75,29.18 R3.13.1 | 36.73,33.3 31.55,33.3 30.48,34.37 30.48,34.52 E3.19 | v37.49,41.07 36.42,41.07 R3.6.2 | 36.73,33.3 v36.73,33.91
  Bottom 0.152: v37.49,41.07 37.49,38.63 36.73,37.87 v36.73,33.91
N$36  (via drill 0.35)
  Top 0.152: E3.6 31.09,38.33 31.09,38.63 31.55,39.09 32.16,39.09 33.98,37.26 35.51,37.26 36.27,38.02 C3.6.1 36.42,38.02 36.88,37.57 v37.34,37.57 | v37.49,34.67 38.1,34.06 39.47,34.06 R3.12.2
  Bottom 0.152: v37.49,34.67 37.49,37.41 v37.34,37.57
N$37
  Top 0.152: 38.71,29.03 36.58,29.03 R3.13.2 | 38.71,29.03 39.47,29.03 R3.11.2 | 38.71,29.03 38.71,31.47 39.47,32.23 R3.12.1
N$38
  Top 0.152: E3.20 31.09,34.52 33.83,34.52 33.98,34.37 35.51,34.37 36.27,35.13 C3.4.2 36.42,35.28 37.34,35.28 38.71,36.65 40.08,36.65 40.23,36.5 40.23,31.62 39.62,31.01 39.62,30.71 R3.11.1
N$39
  Top 0.152: E3.1 31.85,35.28 34.44,35.28 C3.4.1
N$40
  Top 0.152: 30.18,30.1 30.18,32.99 30.02,33.15 30.02,34.52 E3.18 | 30.18,30.1 30.94,29.34 C3.7.1 31.09,29.34 31.7,29.95 34.29,29.95 36.27,31.93 36.27,32.39 R3.10.2 | 30.18,30.1 28.04,30.1 26.98,29.03 26.21,29.03 R3.14.2
N$41
  Top 0.152: E4.2 14.78,35.43 19.51,35.43 21.49,37.41 R4.3.2
N$42  (via drill 0.35)
  Top 0.152: v20.42,37.26 19.05,35.89 14.78,35.89 E4.3 | v22.71,38.63 22.1,38.63 21.64,39.09 R4.4.2
  Bottom 0.152: v20.42,37.26 21.34,37.26 v22.71,38.63
N$43
  Top 0.152: E4.4 14.78,36.35 17.68,36.35 17.98,36.65 17.98,39.09 19.05,40.16 19.51,40.16 19.66,40.31 19.66,43.21 18.9,43.97 C4.2.1
N$44
  Top 0.152: E4.5 14.78,36.8 16.31,36.8 16.46,36.65 17.53,36.65 17.68,36.8 17.68,40.01 17.98,40.31 17.98,43.21 17.22,43.97 C4.2.2 17.22,44.12 17.98,44.88 20.73,44.88 21.18,44.42 21.49,44.42 R4.5.2
N$45
  Top 0.152: C4.1.1 8.53,43.82 11.89,43.82 R4.7.1 12.04,43.97 12.04,44.27 12.8,45.03 14.33,45.03 17.07,42.29 17.07,40.92 R4.6.1
N$46
  Top 0.152: E4.7 13.41,37.72 13.41,40.16 13.72,40.46 C4.3.1 13.72,40.61 13.72,43.82 R4.7.2
N$47
  Top 0.152: 9.3,38.18 8.53,37.41 R4.9.2 | 9.3,38.18 9.45,38.33 12.04,38.33 12.34,38.02 12.34,37.72 E4.9 | 9.3,38.18 9.14,38.18 6.71,40.61 R4.8.1
N$48  (via drill 0.35)
  Top 0.152: 17.98,32.23 19.05,32.23 19.51,31.78 19.51,30.56 18.29,29.34 17.68,29.34 17.07,28.73 R4.13.1 | 17.98,32.23 14.94,32.23 13.41,33.76 13.41,33.91 E4.19 | v18.9,41.99 18.9,40.92 R4.6.2 | 17.98,32.23 v17.98,32.99
  Bottom 0.152: v18.9,41.99 23.62,41.99 24.23,42.6 24.84,42.6 27.89,39.55 27.89,36.96 26.06,35.13 20.12,35.13 v17.98,32.99
N$49  (via drill 0.35)
  Top 0.152: v16,37.72 14.02,37.72 E4.6 | 18.59,38.33 18.59,37.72 18.75,37.57 C4.6.1 | 18.59,38.33 v18.59,38.79 | 18.59,38.33 22.1,38.33 22.4,38.02 22.4,35.13 21.64,34.37 21.64,34.06 R4.12.2
  Bottom 0.152: v16,37.72 17.53,37.72 v18.59,38.79
N$50
  Top 0.152: 20.73,28.58 21.49,28.58 R4.11.2 | 20.73,28.58 18.75,28.58 R4.13.2 | 20.73,28.58 20.73,31.01 21.49,31.78 21.49,32.23 R4.12.1
N$51
  Top 0.152: E4.20 14.02,33.91 16.15,33.91 16.46,33.6 17.98,33.6 18.75,34.37 C4.4.2 18.9,34.37 20.12,33.15 22.1,33.15 22.4,32.84 22.4,31.62 21.64,30.86 21.64,30.4 R4.11.1
N$52
  Top 0.152: E4.1 14.78,34.82 16.61,34.82 16.92,34.52 C4.4.1
N$53
  Top 0.152: 15.09,31.62 12.95,33.76 12.95,33.91 E4.18 | 15.09,31.62 15.09,30.1 13.87,28.88 C4.7.1 13.72,28.88 12.95,29.64 11.43,29.64 10.36,28.58 R4.14.2 | 15.09,31.62 15.39,31.93 17.83,31.93 18.59,31.17 R4.10.2
NEU  (via drill 0.35)
  Top 0.152: 41.15,8.31 40.39,7.54 25.91,7.54 25.6,7.85 25.6,9.07 25.45,9.22 25.45,12.57 25.3,12.73 25.3,15.77 25.15,15.93 24.69,15.93 22.86,17.75 22.86,21.41 21.34,22.94 R1.5.1 | 41.15,8.31 41.15,21.56 39.62,23.09 | R4.5.1 21.64,42.44 21.64,42.14 23.32,40.46 23.32,34.52 25.15,32.69 25.15,29.64 25.3,29.49 25.3,28.42 27.89,25.83 32,25.83 33.68,24.16 33.68,24 35.05,22.63 39.17,22.63 39.47,22.94 R2.5.1 39.62,23.09 | 39.62,23.09 40.54,24 40.54,41.53 39.47,42.6 R3.5.1 | v55.02,12.12 55.47,12.57 57.76,12.57 A1.TIP | 41.15,8.31 v42.52,6.93
  Bottom 0.152: v55.02,12.12 53.8,13.34 51.66,13.34 45.26,6.93 v42.52,6.93
RA  (via drill 0.35)
  Top 0.152: 64.62,22.63 64.77,22.78 A2.RING2 64.62,22.63 | 64.62,22.63 63.25,21.26 62.33,21.26 57.61,16.54 57.61,15.62 54.41,12.42 54.41,8.31 52.88,6.78 51.66,6.78 50.9,7.54 49.53,7.54 M2.1 | v11.12,34.06 10.97,34.21 8.38,34.21 R4.2.1 | v19.96,39.24 21.49,40.77 R4.4.1 21.49,40.92 21.49,41.22 20.42,42.29 v20.42,44.27 | M1.14 43.89,24.61 46.33,22.17 49.38,22.17 M1.1 49.53,22.17 v50.6,23.24 | 53.65,36.8 55.63,34.82 55.63,34.21 52.58,31.17 R8.1 | 53.65,36.8 52.58,36.8 R3.1 | v53.8,39.09 53.19,39.7 | 53.19,39.7 52.73,40.16 R5.1 | 53.65,36.8 v53.8,36.96 | 53.19,39.7 v55.32,41.83 | v62.94,24.31 64.62,22.63
  Bottom 0.152: v11.12,34.06 14.78,34.06 v19.96,39.24 | v53.8,39.09 v53.8,36.96 53.8,27.51 53.03,26.75 | v50.6,23.24 50.6,24.31 53.03,26.75 | v20.42,44.27 35.05,44.27 36.27,45.49 51.66,45.49 v55.32,41.83 | v62.94,24.31 55.47,24.31 53.03,26.75
RA+LA
  Top 0.152: 52.58,41.53 49.53,41.53 49.38,41.68 M3.5 | 52.58,41.53 53.34,42.29 53.34,45.49 52.58,46.25 R6.2 | 52.58,41.53 R5.2
RA+LL  (via drill 0.35)
  Top 0.152: v51.97,14.71 52.27,15.01 52.27,15.62 R4.2 | v50.6,13.34 50.14,13.34 49.53,12.73 M2.5 | v55.02,34.52 53.95,35.59 52.58,35.59 R3.2
  Bottom 0.152: v50.6,13.34 v51.97,14.71 50.14,16.54 50.14,17.6 50.44,17.91 57.45,17.91 63.55,24 63.55,24.61 55.02,33.15 v55.02,34.52
REFOUT_1
  Top 0.152: 11.73,21.56 12.65,20.65 12.65,18.21 E1.8 | R1.8.2 8.53,21.41 11.43,21.41 11.58,21.56 C1.3.2 11.73,21.56 | 11.73,21.56 12.34,22.17 12.34,25.22 12.65,25.53 13.87,25.53 14.17,25.22 14.17,22.17 16.31,20.04 16.31,18.21 C1.6.2
REFOUT_2  (via drill 0.35)
  Top 0.152: E2.8 30.48,18.67 v30.48,19.43 30.48,20.35 29.57,21.26 C2.3.2 29.41,21.41 R2.8.2 | v31.7,19.43 33.38,19.43 34.59,18.21 C2.6.2
  Bottom 0.152: v30.48,19.43 v31.7,19.43
REFOUT_3
  Top 0.152: E3.8 30.02,38.33 30.02,40.01 28.96,41.07 C3.3.2 28.8,41.07 26.21,41.07 R3.8.2 26.06,41.07 25.3,41.83 25.3,44.58 26.06,45.34 31.39,45.34 31.85,44.88 31.85,44.73 34.29,42.29 37.19,42.29 38.1,41.38 38.1,40.77 37.8,40.46 37.34,40.46 35.05,38.18 34.59,38.18 C3.6.2
REFOUT_4
  Top 0.152: E4.8 12.95,37.72 12.95,39.7 12.19,40.46 C4.3.2 | R4.8.2 8.38,40.61 12.04,40.61 C4.3.2 | C4.6.2 16.92,37.57 16.92,39.55 14.48,41.99 14.48,44.42 14.17,44.73 12.95,44.73 12.8,44.58 12.8,41.22 12.19,40.61 C4.3.2
S0  (via drill 0.35)
  Top 0.152: v44.5,19.58 44.65,19.43 44.65,16.08 43.89,15.32 M2.10 | v44.96,29.64 43.89,29.64 M1.10 | C1.8 3.35,34.37 3.35,41.83 7.47,45.95 39.32,45.95 41,44.27 M3.10 44.65,44.27 47.85,41.07 49.99,41.07 50.14,40.92 v51.21,40.92
  Bottom 0.152: v44.5,19.58 43.28,20.8 43.28,27.97 v44.96,29.64 44.96,34.98 49.84,39.85 49.84,40.61 50.14,40.92 v51.21,40.92
S1  (via drill 0.35)
  Top 0.152: v43.89,21.11 43.89,16.54 M2.9 | 45.41,30.4 44.35,30.4 43.89,30.86 M1.9 | v44.81,44.88 44.2,45.49 43.74,45.49 M3.9 | v44.81,41.07 44.81,40.77 45.41,40.16 45.41,30.4 | 45.41,30.4 v45.57,30.4
  Bottom 0.152: v43.89,21.11 43.89,27.66 45.57,29.34 v45.57,30.4 | v44.81,41.07 v44.81,44.88 36.12,44.88 34.9,43.66 17.07,43.66 4.12,30.71 2.13,30.71 C1.7
SDN  (via drill 0.35)
  Top 0.152: 9.75,16.38 3.05,16.38 2.13,15.47 C1.1 1.98,15.32 R0.1 | 9.75,16.38 10.82,16.38 E1.13 | v24.38,17.15 27.58,17.15 27.89,16.84 28.65,16.84 E2.13 | 9.75,16.38 v9.75,14.71 | v10.21,35.43 10.67,35.89 10.97,35.89 E4.13 | v26.36,36.35 28.04,36.35 E3.13
  Bottom 0.152: 20.73,17.15 18.9,17.15 16.46,14.71 v9.75,14.71 | 20.73,17.15 v24.38,17.15 | 10.21,33.45 10.21,29.79 20.73,19.28 20.73,17.15 | 10.21,33.45 v10.21,35.43 | v26.36,36.35 25.15,36.35 24.23,35.43 16.61,35.43 14.63,33.45 10.21,33.45
SIGNAL_1
  Top 0.152: E1.10 11.58,18.06 9.91,18.06 9.14,17.3 7.62,17.3 6.86,18.06 R1.9.1 6.71,18.21 6.71,19.89 5.94,20.65 5.94,24.46 | 5.94,24.46 5.49,24.46 1.98,27.97 C1.6 | 5.94,24.46 6.71,24.46 C1.1.2
SIGNAL_2  (via drill 0.35)
  Top 0.152: E2.10 29.41,18.52 27.74,18.52 26.67,17.45 25.3,17.45 24.54,18.21 R2.9.1 24.38,18.36 23.16,19.58 23.16,21.56 24.23,22.63 24.23,24.31 C2.1.2 24.23,24.46 21.95,26.75 v4.12,26.75
  Bottom 0.152: v4.12,26.75 2.9,25.53 2.13,25.53 C1.5
SIGNAL_3  (via drill 0.35)
  Top 0.152: v27.28,38.18 28.96,38.18 E3.10 | v24.69,36.8 24.69,37.57 24.38,37.87 R3.9.1 | v24.54,41.99 24.54,43.97 C3.1.2
  Bottom 0.152: 26.06,38.18 v27.28,38.18 | v24.69,36.8 26.06,38.18 | 24.54,39.85 24.54,39.7 26.06,38.18 | 24.54,39.85 v24.54,41.99 | 24.54,39.85 13.72,39.85 4.72,30.86 4.72,26.44 2.13,23.85 2.13,23.09 C1.4
SIGNAL_4  (via drill 0.35)
  Top 0.152: E4.10 11.89,37.57 10.06,37.57 9.14,36.65 7.47,36.65 6.71,37.41 R4.9.1 6.55,37.41 | 6.55,37.41 5.79,38.18 5.79,41.22 6.55,41.99 6.55,43.66 C4.1.2 | v5.33,29.64 5.33,32.84 4.88,33.3 4.88,35.74 6.55,37.41
  Bottom 0.152: v5.33,29.64 5.33,24.46 2.13,21.26 2.13,20.5 C1.3
V1  (via drill 0.35)
  Top 0.152: v50.75,17.3 44.81,23.24 43.89,23.24 M1.15 | v62.18,5.87 62.18,5.26 64.77,2.67 A3.RING2
  Bottom 0.152: v62.18,5.87 v50.75,17.3
V2
  Top 0.152: M2.15 43.89,8.76 45.41,8.76 51.51,2.67 57.76,2.67 A3.TIP
V3  (via drill 0.35)
  Top 0.152: v44.81,38.48 44.35,38.02 43.74,38.02 M3.15 | v61.87,4.5 61.87,2.67 A3.RING1
  Bottom 0.152: v44.81,38.48 45.87,38.48 50.29,42.9 53.8,42.9 54.71,41.99 54.71,35.74 61.57,28.88 61.57,27.05 63.86,24.77 63.86,6.48 v61.87,4.5
V4
  Top 0.152: M1.11 43.89,28.27 48.16,28.27 48.62,27.81 59.28,27.81 A4.RING2
V5
  Top 0.152: M2.11 43.74,14.1 43.13,14.1 41.91,15.32 41.91,22.48 41.3,23.09 41.3,27.2 43.13,29.03 53.49,29.03 A4.TIP
V6
  Top 0.152: M3.11 43.74,42.9 45.57,42.9 48.62,39.85 49.99,39.85 51.66,38.18 58.83,38.18 58.98,38.33 60.05,38.33 61.72,36.65 61.72,33.45 A4.RING1
WCT  (via drill 0.35)
  Top 0.152: 51.51,26.29 51.51,26.44 52.12,27.05 52.43,27.05 R9.2 | 51.51,26.29 51.51,25.07 52.27,24.31 52.27,22.17 R7.2 | M1.2 49.53,23.39 50.29,24.16 50.29,25.07 49.53,25.83 M1.4 49.38,25.83 v47.09,25.83 | M2.2 49.53,8.92 50.29,9.68 50.29,10.59 49.53,11.35 M2.4 49.38,11.51 49.07,11.51 v46.63,13.94 | 49.68,37.57 49.38,37.87 M3.2 | 49.68,37.57 50.14,37.11 50.14,36.8 52.43,34.52 52.43,32.54 R8.2 | M3.4 50.29,40.46 v50.44,40.31 | 49.68,37.57 v50.44,38.33 | v51.21,26.29 51.51,26.29
  Bottom 0.152: v50.44,40.31 v50.44,38.33 50.44,33.76 44.65,27.97 44.65,27.36 46.63,25.37 | 46.63,25.37 v46.63,13.94 | 46.63,25.37 v47.09,25.83 47.55,26.29 v51.21,26.29

### Text on the board
tNames: GND | 3V3 | S0 | S1 | SIG_1 | SIG_2 | SIG_3 | SIG_4 | A_SIG | SDN